# Altium schematic sheet ECOSYNC new.SchDoc
size A; SheetNumber: 1; SheetTotal: 1
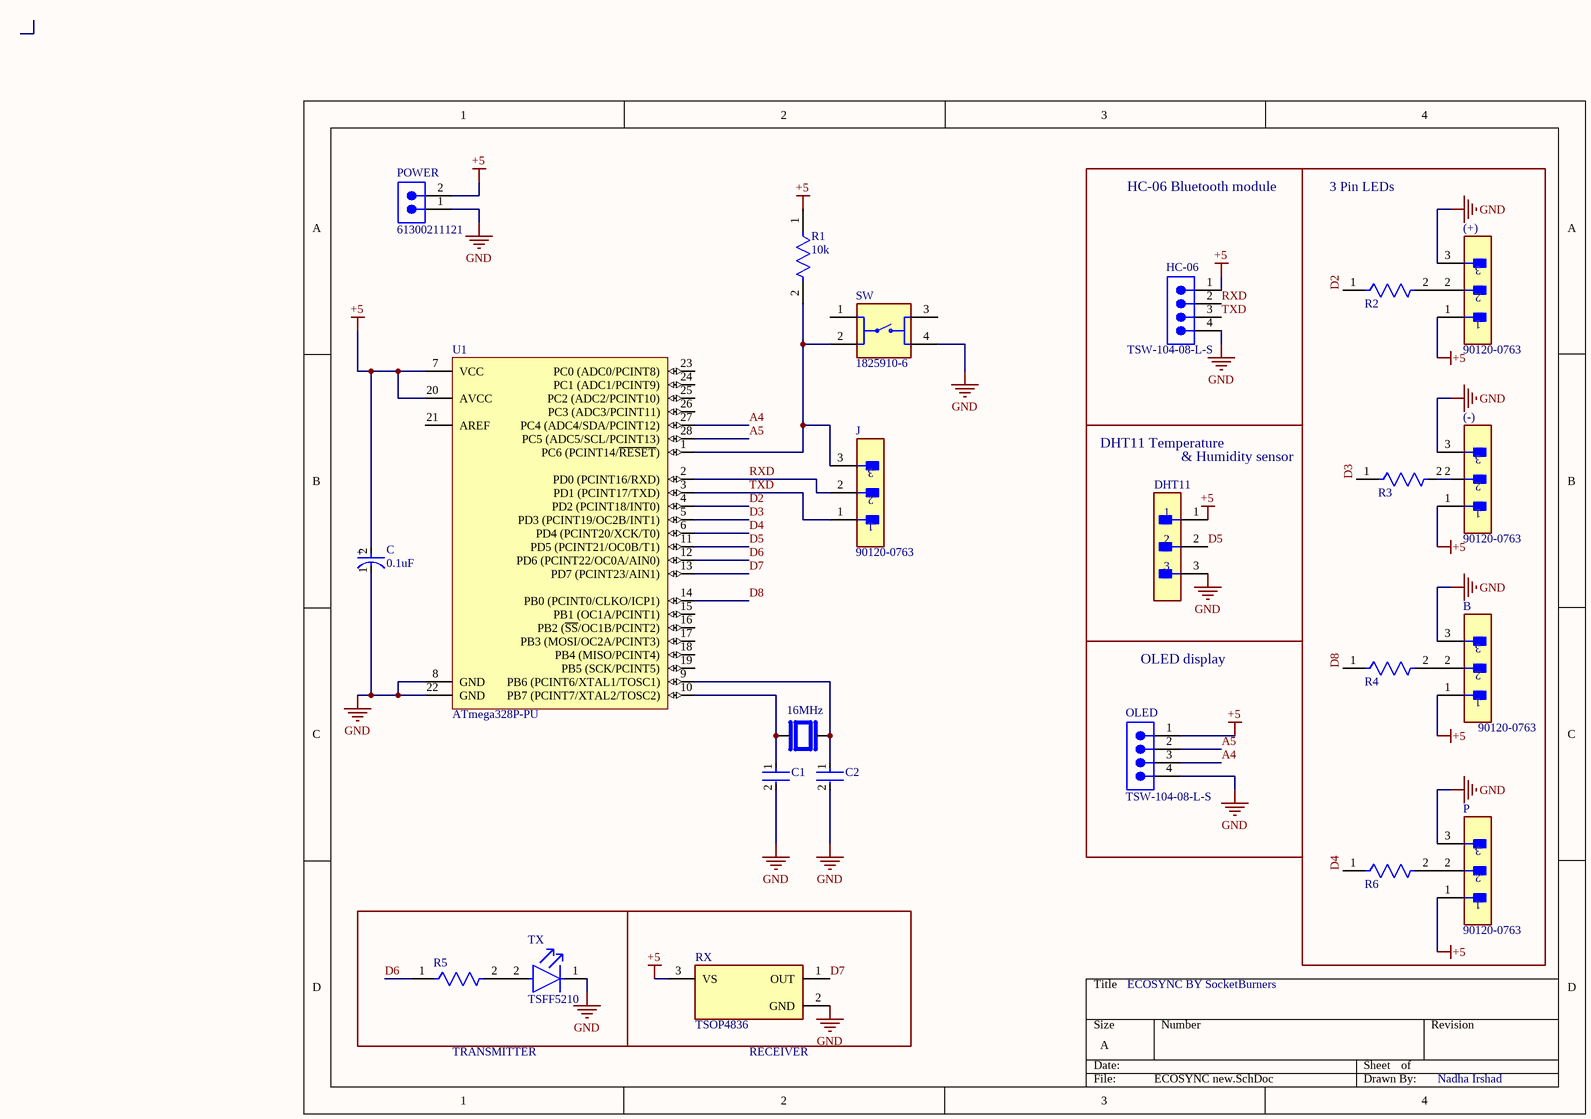
[diagram p0: ECOSYNC new.SchDoc]

## Parts
16MHz  ABL-16.000MHZ-B2  [XTAL_HC49P488W46L1150T500H350]  (value not drawn)
(+)  90120-0763  [FP-90120-0763-MFG]
(-)  90120-0763  [FP-90120-0763-MFG]
B  90120-0763  [FP-90120-0763-MFG]
C  0.1uF  [FP-RAD-TH-D_6_3_0_5-L_11-MFG]
C1  RDE5C2A220J0M1H03A  [FP-RDE0M1-MFG]  (value not drawn)
C2  RDE5C2A220J0M1H03A  [FP-RDE0M1-MFG]  (value not drawn)
DHT11  90120-0763  [FP-90120-0763-MFG]  (value not drawn)
HC-06  TSW-104-08-L-S  [SMTC-TSW-104-08-X-S]
J  90120-0763  [FP-90120-0763-MFG]
OLED  TSW-104-08-L-S  [SMTC-TSW-104-08-X-S]
P  90120-0763  [FP-90120-0763-MFG]
POWER  61300211121  [61300211121]
R1  10k  [FP-CF18-MFG]
R2  CF18JT10K0  [FP-CF18-MFG]  (value not drawn)
R3  CF18JT10K0  [FP-CF18-MFG]  (value not drawn)
R4  CF18JT10K0  [FP-CF18-MFG]  (value not drawn)
R5  CF18JT10K0  [FP-CF18-MFG]  (value not drawn)
R6  CF18JT10K0  [FP-CF18-MFG]  (value not drawn)
RX  TSOP4836  [FP-6_550-5169_01-4-MFG]
SW  1825910-6  [SW_1825910-6-4]
TX  TSFF5210  [FP-6_544-5258_09-4-MFG]
U1  ATmega328P-PU  [28P3]

## Blocks framed on the sheet
HC-06 Bluetooth module: HC-06
3 Pin LEDs: (+) (-) B P R2-R4 R6
OLED display: OLED

## Nets
+5: (+).1 (-).1 B.1 C.2(A) DHT11.1 HC-06.1 OLED.1 P.1 POWER.2 R1.1 RX.3(VS) U1.7(VCC) U1.20(AVCC)
GND: (+).3 (-).3 B.3 C.1(C) C1.2 C2.2 DHT11.3 HC-06.4 OLED.4 P.3 POWER.1 RX.2(GND) SW.4 TX.1(C) U1.8(GND) U1.22(GND)
A4: OLED.3 U1.27(PC4_(ADC4/SDA/PCINT12))
A5: OLED.2 U1.28(PC5_(ADC5/SCL/PCINT13))
D2: R2.1 U1.4(PD2_(PCINT18/INT0))
D3: R3.1 U1.5(PD3_(PCINT19/OC2B/INT1))
D4: R6.1 U1.6(PD4_(PCINT20/XCK/T0))
D5: DHT11.2 U1.11(PD5_(PCINT21/OC0B/T1))
D6: R5.1 U1.12(PD6_(PCINT22/OC0A/AIN0))
D7: RX.1(OUT) U1.13(PD7_(PCINT23/AIN1))
D8: R4.1 U1.14(PB0_(PCINT0/CLKO/ICP1))
RXD: HC-06.2 J.2 U1.2(PD0_(PCINT16/RXD))
TXD: HC-06.3 J.1 U1.3(PD1_(PCINT17/TXD))
Net16MHz_1: 16MHz.1 C1.1 U1.10(PB7_(PCINT7/XTAL2/TOSC2))
Net16MHz_2: 16MHz.2 C2.1 U1.9(PB6_(PCINT6/XTAL1/TOSC1))
Net(+)_2: (+).2 R2.2
Net(-)_2: (-).2 R3.2
NetB_2: B.2 R4.2
NetJ_3: J.3 R1.2 SW.2 U1.1(PC6_(PCINT14/~{RESET}))
NetP_2: P.2 R6.2
NetR5_2: R5.2 TX.2(A)

Not connected (* = marked no-connect by the designer): SW 1 3; U1 15(PB1_(OC1A/PCINT1)) 16(PB2_(~{SS}/OC1B/PCINT2)) 17(PB3_(MOSI/OC2A/PCINT3)) 18(PB4_(MISO/PCINT4)) 19(PB5_(SCK/PCINT5)) 21(AREF) 23(PC0_(ADC0/PCINT8)) 24(PC1_(ADC1/PCINT9)) 25(PC2_(ADC2/PCINT10)) 26(PC3_(ADC3/PCINT11))

## Notes on the sheet
- DHT11 Temperature
- & Humidity sensor
- ECOSYNC BY SocketBurners
- TRANSMITTER
- (near RX) RECEIVER
- Nadha Irshad
- (in symbol CMP-05427-001214-1) +

## Library data of the parts
16MHz = ABL-16.000MHZ-B2: HC/49US (AT49) MICROPROCESSOR CRYSTAL; MF: Abracon; Availability: In Stock; SnapEDA_Link: https://www.snapeda.com/parts/ABL-16.000MHZ-B2/Abracon+LLC/view-part/?ref=snap; MP: ABL-16.000MHZ-B2; Price: None; Value: *; Check_prices: https://www.snapeda.com/parts/ABL-16.000MHZ-B2/Abracon+LLC/view-part/?ref=eda; Purchase-URL: https://pricing.snapeda.com/search/part/ABL-16.000MHZ-B2/?ref=eda; Package: HC-49/US ABRACON
(+) (-) B DHT11 J P = CMP-04776-000084-1: CONN HEADER VERT 3POS 2.54MM; Manufacturer: Molex; Voltage Rating: 350V; Number Of Contacts: 3; Conn Orientation: Vertical; Current Rating: 3A; Conn Gender: Male; Package: 90120-0763; ComponentLink2Description: Datasheet; Height: 5.8mm; Manufacturer Part Number: 90120-0763; Temperature Range High: +125°C; RoHS: TRUE; ComponentLink2URL: https://www.molex.com/webdocs/datasheets/pdf/en-us/0901200763_PCB_HEADERS.pdf; Device Class L2: Headers and Wire Housings; Temperature: -55°C to +125°C; Device Class L1: Connectors; Pitch: 2.54mm; Footprint Url: https://www.molex.com/pdm_docs/sd/901200763_sd.pdf; Device Class L3: unset; Temperature Range Low: -55°C; Number Of Rows: 1; Category: Conn; Lead Free: Yes; Mouser Description: Board-To-Board Connector, C-Grid III 90120 Series, Through Hole, Header, 3, 2.54 mm; Octopart: https://octopart.com/90120-0763-molex-655433; Contact Material: Gold,Nickel; Automotive: No; Digikey Description: CONN HEADER VERT 3POS 2.54MM
C = CMP-05427-001214-1: Aluminum Electrolytic Capacitors (Radial Lead Type) 330uF ±20% 6.3V; ESR (Equivalent Series Resistance): 130mR; Lead Diameter: 0.5mm; Ripple Current: 455mA; Polarity: Polar; Life (Hours): 2000Hour; Package Quantity: 2000; RoHS Compliant: Yes; Diameter: 6.3mm; Features: General Purpose; Voltage Rating: 6.3V; Length: 11.2mm; Voltage Rating (DC): 6.3V; Mount: Through Hole; Min Operating Temperature: -40°C; Height: 11.2mm; Termination: Radial; Radiation Hardening: No; Capacitance: 330uF; Case/Package: Radial; Packaging: Ammo Pack; Tolerance: 20%; Height - Seated (Max): 0.5inch; Series: FR; Lead Pitch: 5mm; Max Operating Temperature: 105°C; Impedance: 130mR
C1 C2 = CMP-06035-022985-1: Ceramic Capacitor 22pF ±5% 100V C0G Radial; Lead Diameter: 0.5mm; Mount: Through Hole; Min Operating Temperature: -55°C; Height: 3.5mm; Width: 0.098inch; Packaging: Cut Tape; Resistor Type: Ceramic; Case/Package: Radial; Capacitance: 22pF; Voltage Rating: 100V; Height - Seated (Max): 0.236inch; Max Operating Temperature: 125°C; Dielectric: C0G; Package Quantity: 1; Voltage Rating (DC): 100V; Lead Free: Lead Free; Lead Pitch: 0.197inch; Termination: Radial; Tolerance: 5%; Length: 0.157inch
HC-06 OLED = CMP-1024-00358-1: 0.025" SQ Post Header, Through-hole, Vertical, -55 to 125 degC, 2.54 mm Pitch, 4-Pin, Male, RoHS; Manufacturer: Samtec; Pitch: 2.54 mm; PartNumber: TSW-104-08-L-S; RoHS: True; Temperature Range: -55 to 125 degC; PackageDescription: .025[0.64] SQ. Post Terminal Strip Assembly; Orientation: Vertical; ComponentLink2URL: http://www.samtec.com/documents/webfiles/pdf/TSW_TH.PDF; ComponentLink1Description: Manufacturer URL; ComponentLink2Description: Datasheet; PackageVersion: DM, 8/1988; ComponentLink3URL: http://www.samtec.com/documents/webfiles/cpdf/TSW-XXX-XX-XXX-X-XX-XXX-MKT.pdf; Mounting Technology: Through-hole; PackageReference: TSW-104-08-X-S; ComponentLink3Description: Package Specification; ComponentLink1URL: http://www.samtec.com; DatasheetVersion: F-214
POWER = CMP-1712-00002-6: NexarPartId: 20081794; Number of Contacts: 2; Pitch: 2.54mm; Connector Type: Male Pin; Voltage Rating: 250V; Current Rating: 3A; Gender: Male; Contact Resistance: 20mΩ; Height: 8.94mm; Lead Free: Lead Free; Number of Pins: 2; Termination: Through Hole; RoHS: Compliant; Lead Pitch: 2.54mm; REACH SVHC: No SVHC; Housing Material: PBT; Contact Mating Length: 5.9944mm; Min Operating Temperature: -40°C; Orientation: Vertical; Contact Material: Copper; Contact Gender: Male; Max Operating Temperature: 125°C; Number of Rows: 1; Number of Positions: 2; Packaging: Bulk; Contact Plating: Gold; Mount: Through Hole; Color: Black; Operating Supply Voltage: 250V
R1 = CMP-26528-000002-1: RES 10K OHM 1/8W 5% CF AXIAL; Manufacturer Part Number: CF18JT10K0; Manufacturer: Stackpole Electronics; Power Rating: 0.125W; Temperature Coefficient: 0-500ppm/°C; Resistance: 10kΩ; Voltage Rating: 250V; Value: 10kΩ; Temperature: -55°C to +155°C; Height: 2mm; Lead Free: Yes; Automotive: No; Device Class L2: Resistors; Package: CF18; Series: CF; ComponentLink2Description: Datasheet; Ipc Land Pattern Name: RESAD656W65L360D200; Temperature Range High: +155°C; RoHS: TRUE; Device Class L3: Through-Hole Resistors; Temperature Range Low: -55°C; Device Class L1: Passive Components; Category: Res; Octopart: https://octopart.com/cf18jt10k0-stackpole+electronics-19205642; Composition: Carbon Film; Digikey Description: RES 10K OHM 1/8W 5% CF AXIAL; ComponentLink2URL: http://www.seielect.com/Catalog/SEI-CF_CFM.pdf; Tolerance: 5%
R2-R6 = CMP-26528-000002-1: RES 10K OHM 1/8W 5% CF AXIAL; Manufacturer: Stackpole Electronics; Power Rating: 0.125W; Temperature Coefficient: 0-500ppm/°C; Resistance: 10kΩ; Voltage Rating: 250V; Value: 10kΩ; Temperature: -55°C to +155°C; Height: 2mm; Lead Free: Yes; Automotive: No; Device Class L2: Resistors; Package: CF18; Series: CF; ComponentLink2Description: Datasheet; Ipc Land Pattern Name: RESAD656W65L360D200; Manufacturer Part Number: CF18JT10K0; Temperature Range High: +155°C; RoHS: TRUE; Device Class L3: Through-Hole Resistors; Temperature Range Low: -55°C; Device Class L1: Passive Components; Category: Res; Octopart: https://octopart.com/cf18jt10k0-stackpole+electronics-19205642; Composition: Carbon Film; Digikey Description: RES 10K OHM 1/8W 5% CF AXIAL; ComponentLink2URL: http://www.seielect.com/Catalog/SEI-CF_CFM.pdf; Tolerance: 5%
RX = CMP-00030-55401809-1: TSOP4836 TSOP48 Series 5.5 V 36 kHz Through Hole IR Receiver Modules for Remote Control; Min Supply Voltage (DC): 2.5V; Max Supply Voltage (DC): 5.5V; Lead Length: 23.6mm; Power Dissipation: 10mW; Nominal Supply Current: 950µA; Wavelength: 950nm; Sensing Distance: 45m; Operating Supply Current: 700µA; Viewing Angle: 45°; Frequency: 36kHz; Output Current: 5mA; Min Supply Voltage: 2.7V; Height: 6.95mm; RoHS: Compliant; Mount: Through Hole; NexarPartId: 55401809; Case/Package: TSOP; Max Supply Voltage: 5.5V; Width: 5.6mm; REACH SVHC: Unknown; Lead Free: Lead Free; Schedule B: 8541409500; Min Operating Temperature: -25°C; Radiation Hardening: No; Max Operating Temperature: 85°C; Length: 6mm; Contact Plating: Tin; Number of Pins: 3; Orientation: Side View
SW = 1825910-6: Switch Push Button OFF (ON) SPST Round Button 0.05A 24VDC Momentary Contact PC Pins Thru-Hole; MF: TE Connectivity; Value: *; MP: 1825910-6; Package: None; Check_prices: https://www.snapeda.com/parts/1825910-6/TE+Connectivity+ALCOSWITCH+Switches/view-part/?ref=eda; SnapEDA_Link: https://www.snapeda.com/parts/1825910-6/TE+Connectivity+ALCOSWITCH+Switches/view-part/?ref=snap; Digi-Key_Part_Number: 450-1650-ND; Purchase-URL: https://pricing.snapeda.com/search/part/1825910-6/?ref=eda
TX = CMP-00030-41223146-1: TSFF5210 TSFF5210 IR LED, 870nm, T-1 3/4 (5mm) Through Hole package; Number of Elements: 1; Power Dissipation: 180W; Viewing Angle: 20°; Power Rating: 250mW; Test Current: 100mA; Forward Voltage: 1.5V; Lens Style: Circular, Colorless, Diffused, Round; Rise Time: 15ns; Reverse Voltage: 5V; REACH SVHC: Unknown; Packaging: Bulk; Schedule B: 8541402000, 8541402000; Number of LEDs: 1; Mount: Through Hole; Depth: 5.8mm; Max Operating Temperature: 85°C; Radiation Hardening: No; Case/Package: Radial; NexarPartId: 41223146; Lead Free: Lead Free; Number of Pins: 2; Wavelength: 870nm; RoHS: Compliant; Orientation: Top View; Length: 5.8mm; Peak Wavelength: 870nm; Contact Plating: Tin; Min Operating Temperature: -40°C; Forward Current: 100mA
U1 = CMP-0095-00013-2: 8-bit AVR Microcontroller, 32KB Flash, 1KB EEPROM, 2KB SRAM, 28-pin PDIP, Industrial Grade (-40°C to 85°C); RevisionNote: DatasheetVersion updated. URLs added.; PackageVersion: revB, Sep-2001; PackageDescription: 28-lead (0.300"/7.62mm Wide) Plastic Dual Inline Package (PDIP); DatasheetVersion: revD, May-2011; ComponentLink1Description: Manufacturer URL; ComponentLink1URL: http://www.atmel.com/; PackageReference: 28P3; ComponentLink2Description: ATmega48A/48PA/88A/88PA/168A/168PA/328/328P Datasheet; ComponentLink3URL: http://www.atmel.com/dyn/resources/prod_documents/8271S.pdf; ComponentLink2URL: http://www.atmel.com/dyn/resources/prod_documents/8271.pdf; ComponentLink3Description: ATmega48A/48PA/88A/88PA/168A/168PA/328/328P Summary